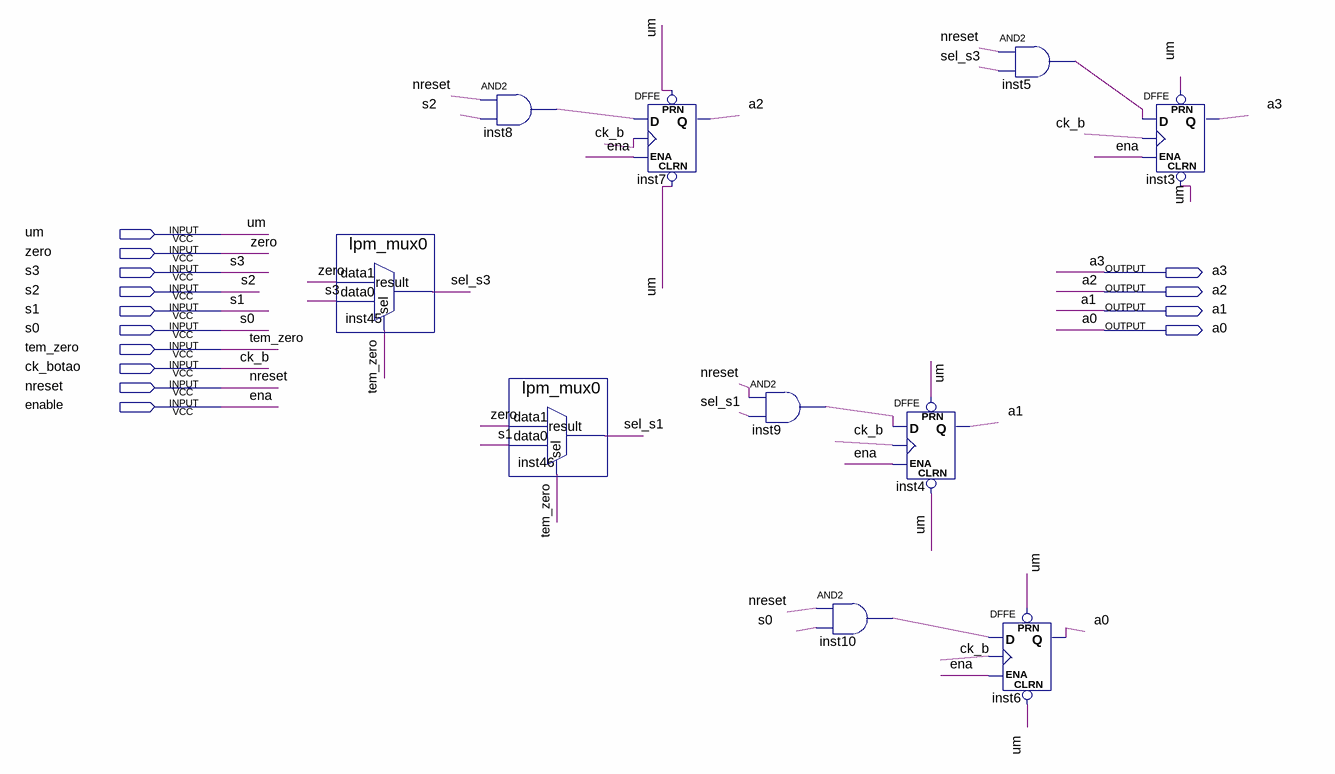
[diagram p0: schematic sheet]
// Quartus schematic registrador_display1.bdf as structural Verilog: 10 symbols, 14 pins
module registrador_display1 (
  input  um,
  input  zero,
  input  s3,
  input  s2,
  input  s1,
  input  s0,
  input  tem_zero,
  input  ck_botao,
  input  nreset,
  input  enable,
  output a3,
  output a2,
  output a1,
  output a0
);

  wire inst5_out, inst8_out, inst9_out, inst10_out, sel_s1, sel_s3;

  lpm_mux0 inst45 (.data1(zero), .data0(s3), .sel(tem_zero), .result(sel_s3));
  and inst8 (inst8_out, nreset, s2);
  lpm_mux0 inst46 (.data1(zero), .data0(s1), .sel(tem_zero), .result(sel_s1));
  DFFE inst7 (.PRN(um), .CLRN(um), .D(inst8_out), .CLK(ck_botao), .ENA(enable), .Q(a2));
  and inst9 (inst9_out, nreset, sel_s1);
  and inst10 (inst10_out, nreset, s0);
  DFFE inst4 (.PRN(um), .CLRN(um), .D(inst9_out), .CLK(ck_botao), .ENA(enable), .Q(a1));
  DFFE inst6 (.PRN(um), .CLRN(um), .D(inst10_out), .CLK(ck_botao), .ENA(enable), .Q(a0));
  and inst5 (inst5_out, nreset, sel_s3);
  DFFE inst3 (.PRN(um), .CLRN(um), .D(inst5_out), .CLK(ck_botao), .ENA(enable), .Q(a3));

  // Other names for the same wires on the sheet: ck_b = ck_botao; ena = enable
endmodule
